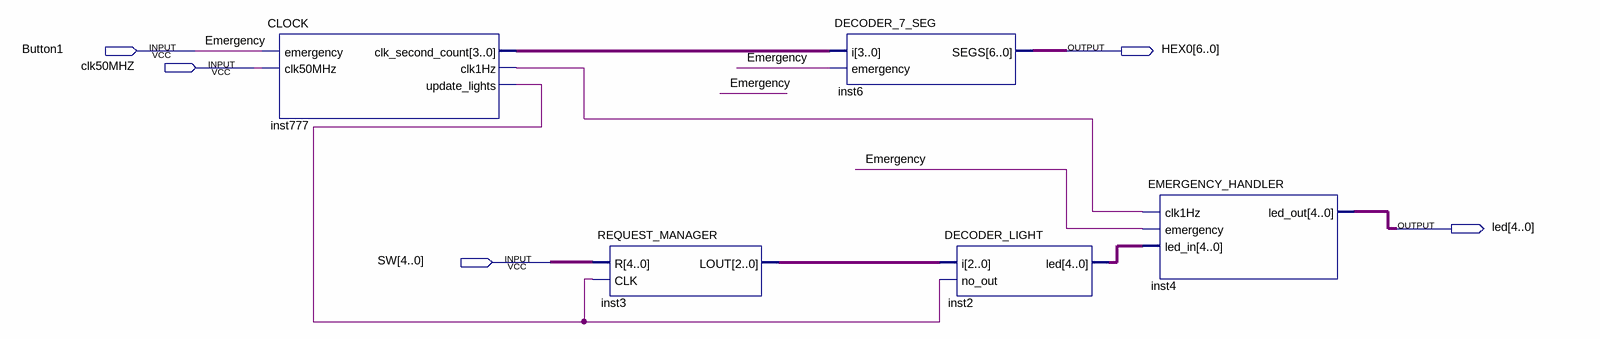
[diagram p0: schematic sheet]
// Quartus schematic Design_Assignment.bdf as structural Verilog: 5 symbols, 5 pins
module Design_Assignment (
  input  Button1,
  input  clk50MHZ,
  input  [4:0] SW,
  output [6:0] HEX0,
  output [4:0] led
);

  wire inst777_clk1hz, inst777_update_lights;
  wire [2:0] inst3_lout;
  wire [3:0] inst777_clk_second_count;
  wire [4:0] inst2_led;

  CLOCK inst777 (
    .emergency(Button1), .clk50MHz(clk50MHZ), .clk_second_count(inst777_clk_second_count),
    .clk1Hz(inst777_clk1hz), .update_lights(inst777_update_lights));
  REQUEST_MANAGER inst3 (.R(SW), .CLK(inst777_update_lights), .LOUT(inst3_lout));
  DECODER_7_SEG inst6 (.i(inst777_clk_second_count), .emergency(Button1), .SEGS(HEX0));
  DECODER_LIGHT inst2 (.i(inst3_lout), .no_out(inst777_update_lights), .led(inst2_led));
  EMERGENCY_HANDLER inst4 (.clk1Hz(inst777_clk1hz), .emergency(Button1), .led_in(inst2_led), .led_out(led));

  // Other names for the same wires on the sheet: Emergency = Button1
endmodule
